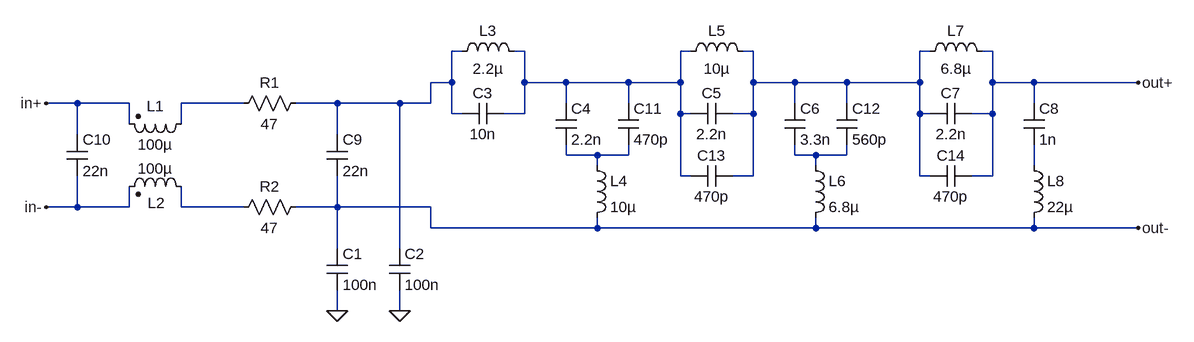
[diagram p0: schematic EMI_filter_design.asc]
EMI_filter_design.asc, the LTspice schematic file:
Version 4
SHEET 1 1788 680
WIRE 672 -48 656 -48
WIRE 768 -48 752 -48
WIRE 1024 -48 1008 -48
WIRE 1120 -48 1104 -48
WIRE 1392 -48 1376 -48
WIRE 1488 -48 1472 -48
WIRE 656 0 656 -48
WIRE 656 0 624 0
WIRE 768 0 768 -48
WIRE 832 0 768 0
WIRE 928 0 832 0
WIRE 1008 0 1008 -48
WIRE 1008 0 928 0
WIRE 1120 0 1120 -48
WIRE 1184 0 1120 0
WIRE 1264 0 1184 0
WIRE 1376 0 1376 -48
WIRE 1376 0 1264 0
WIRE 1488 0 1488 -48
WIRE 1552 0 1488 0
WIRE 1712 0 1552 0
WIRE 80 32 32 32
WIRE 160 32 80 32
WIRE 336 32 240 32
WIRE 480 32 416 32
WIRE 576 32 480 32
WIRE 624 32 624 0
WIRE 624 32 576 32
WIRE 832 32 832 0
WIRE 928 32 928 0
WIRE 1184 32 1184 0
WIRE 1264 32 1264 0
WIRE 1552 32 1552 0
WIRE 656 48 656 0
WIRE 672 48 656 48
WIRE 768 48 768 0
WIRE 768 48 736 48
WIRE 1008 48 1008 0
WIRE 1024 48 1008 48
WIRE 1120 48 1120 0
WIRE 1120 48 1088 48
WIRE 1376 48 1376 0
WIRE 1392 48 1376 48
WIRE 1488 48 1488 0
WIRE 1488 48 1456 48
WIRE 160 64 160 32
WIRE 240 64 240 32
WIRE 80 80 80 32
WIRE 480 80 480 32
WIRE 832 112 832 96
WIRE 880 112 832 112
WIRE 928 112 928 96
WIRE 928 112 880 112
WIRE 1184 112 1184 96
WIRE 1216 112 1184 112
WIRE 1264 112 1264 96
WIRE 1264 112 1216 112
WIRE 880 128 880 112
WIRE 1216 128 1216 112
WIRE 1552 128 1552 96
WIRE 1008 144 1008 48
WIRE 1024 144 1008 144
WIRE 1120 144 1120 48
WIRE 1120 144 1088 144
WIRE 1376 144 1376 48
WIRE 1392 144 1376 144
WIRE 1488 144 1488 48
WIRE 1488 144 1456 144
WIRE 80 192 80 144
WIRE 80 192 32 192
WIRE 160 192 160 160
WIRE 160 192 80 192
WIRE 240 192 240 160
WIRE 336 192 240 192
WIRE 480 192 480 144
WIRE 480 192 416 192
WIRE 624 192 480 192
WIRE 624 224 624 192
WIRE 880 224 880 208
WIRE 880 224 624 224
WIRE 1216 224 1216 208
WIRE 1216 224 880 224
WIRE 1552 224 1552 208
WIRE 1552 224 1216 224
WIRE 1712 224 1552 224
WIRE 480 256 480 192
WIRE 576 256 576 32
WIRE 480 352 480 320
WIRE 576 352 576 320
FLAG 480 352 0
FLAG 576 352 0
FLAG 1712 0 out+
FLAG 1712 224 out-
FLAG 32 32 in+
FLAG 32 192 in-
SYMBOL res 432 16 R90
WINDOW 0 0 56 VBottom 2
WINDOW 3 32 56 VTop 2
SYMATTR InstName R1
SYMATTR Value 47
SYMBOL res 432 176 R90
WINDOW 0 0 56 VBottom 2
WINDOW 3 32 56 VTop 2
SYMATTR InstName R2
SYMATTR Value 47
SYMBOL ind2 256 48 R90
WINDOW 0 4 56 VBottom 2
WINDOW 3 32 56 VTop 2
SYMATTR InstName L1
SYMATTR Value 100µ
SYMBOL ind2 256 176 M270
WINDOW 0 -25 54 VTop 2
WINDOW 3 59 56 VBottom 2
SYMATTR InstName L2
SYMATTR Value 100µ
SYMBOL cap 464 256 R0
SYMATTR InstName C1
SYMATTR Value 100n
SYMBOL cap 560 256 R0
SYMATTR InstName C2
SYMATTR Value 100n
SYMBOL ind 656 -32 R270
WINDOW 0 32 56 VTop 2
WINDOW 3 5 56 VBottom 2
SYMATTR InstName L3
SYMATTR Value 2.2µ
SYMBOL cap 736 32 R90
WINDOW 0 0 32 VBottom 2
WINDOW 3 32 32 VTop 2
SYMATTR InstName C3
SYMATTR Value 10n
SYMBOL cap 816 32 R0
SYMATTR InstName C4
SYMATTR Value 2.2n
SYMBOL ind 864 112 R0
SYMATTR InstName L4
SYMATTR Value 10µ
SYMBOL ind 1008 -32 R270
WINDOW 0 32 56 VTop 2
WINDOW 3 5 56 VBottom 2
SYMATTR InstName L5
SYMATTR Value 10µ
SYMBOL cap 1088 32 R90
WINDOW 0 0 32 VBottom 2
WINDOW 3 32 32 VTop 2
SYMATTR InstName C5
SYMATTR Value 2.2n
SYMBOL cap 1168 32 R0
SYMATTR InstName C6
SYMATTR Value 3.3n
SYMBOL ind 1200 112 R0
SYMATTR InstName L6
SYMATTR Value 6.8µ
SYMBOL ind 1376 -32 R270
WINDOW 0 32 56 VTop 2
WINDOW 3 5 56 VBottom 2
SYMATTR InstName L7
SYMATTR Value 6.8µ
SYMBOL cap 1456 32 R90
WINDOW 0 0 32 VBottom 2
WINDOW 3 32 32 VTop 2
SYMATTR InstName C7
SYMATTR Value 2.2n
SYMBOL cap 1536 32 R0
SYMATTR InstName C8
SYMATTR Value 1n
SYMBOL ind 1536 112 R0
SYMATTR InstName L8
SYMATTR Value 22µ
SYMBOL cap 464 80 R0
SYMATTR InstName C9
SYMATTR Value 22n
SYMBOL cap 64 80 R0
SYMATTR InstName C10
SYMATTR Value 22n
SYMBOL cap 912 32 R0
SYMATTR InstName C11
SYMATTR Value 470p
SYMBOL cap 1248 32 R0
SYMATTR InstName C12
SYMATTR Value 560p
SYMBOL cap 1088 128 R90
WINDOW 0 0 32 VBottom 2
WINDOW 3 32 32 VTop 2
SYMATTR InstName C13
SYMATTR Value 470p
SYMBOL cap 1456 128 R90
WINDOW 0 0 32 VBottom 2
WINDOW 3 32 32 VTop 2
SYMATTR InstName C14
SYMATTR Value 470p

The netlist it stands for:
* EMI_filter_design.asc
R1 N001 N004 47
R2 out- N008 47
L1 N004 in+ 100µ
L2 N008 in- 100µ
C1 out- 0 100n
C2 N001 0 100n
L3 N001 N002 2.2µ
C3 N002 N001 10n
C4 N002 N005 2.2n
L4 N005 out- 10µ
L5 N002 N003 10µ
C5 N003 N002 2.2n
C6 N003 N006 3.3n
L6 N006 out- 6.8µ
L7 N003 out+ 6.8µ
C7 out+ N003 2.2n
C8 out+ N007 1n
L8 N007 out- 22µ
C9 N001 out- 22n
C10 in+ in- 22n
C11 N002 N005 470p
C12 N003 N006 560p
C13 N003 N002 470p
C14 out+ N003 470p
.backanno
.end